# Altium project PCCC V1.1.0_001.PrjPcb
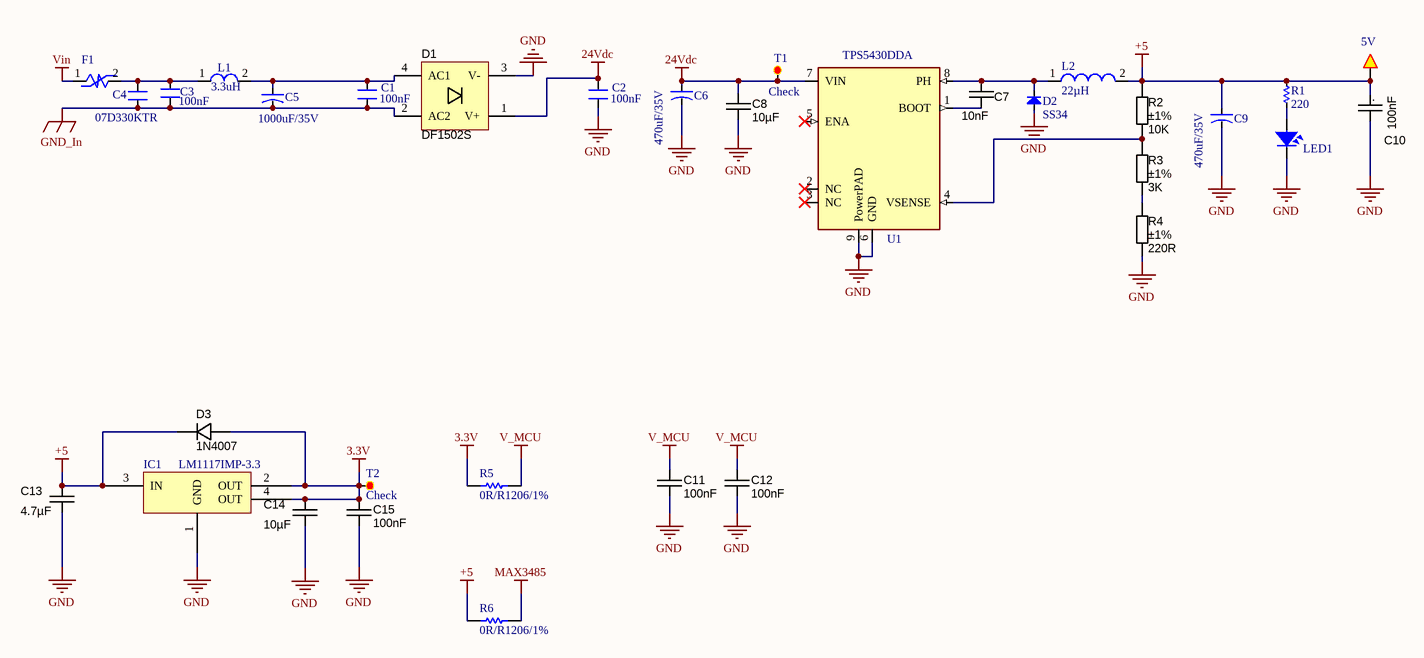
[diagram p0: Power - Switch Power.SchDoc]
8 sheets, 93 parts. Net scope: flat (ports and power ports of the same name join across sheets).
Board file: PCCC V1.1.0_001.PcbDoc
Sheets:
  Block Diagram.SchDoc
  Power - Switch Power.SchDoc
  Modbus RTU.SchDoc
  Module 4G.SchDoc
  SD Card.SchDoc
  Input Digital.SchDoc
  Led Status.SchDoc
  MCU.SchDoc

## Sheet Block Diagram.SchDoc
size A3; SheetNumber: 1; SheetTotal: 8

### Notes on the sheet
- Title
- Size:
- Date:
- A3
- Number:
- Time:
- Revision:
- Sheet
- of
- NICHIETSUVN.COM <http://NICHIETSUVN.COM>
- R&D
- File:

## Sheet Power - Switch Power.SchDoc
size A3; SheetNumber: 2; SheetTotal: 8

### Parts
C1  100nF  [CN-SMD-1206]
C2  100nF  [CN-SMD-1206]
C3  100nF  [CN2.5]
C4  07D330KTR  [CN2-T]
C5  1000uF/35V  [CA-ALU-5L]
C6  470uF/35V  [CA-ALU-6.3]
C7  10nF  [CAPC1608X90N]
C8  10µF  [CAPC2012X135N]
C9  470uF/35V  [CA-ALU-6.3]
C10  100nF  [CAPC2012X135N]
C11  100nF  [CAPC1608X90N]
C12  100nF  [CAPC1608X90N]
C13  4.7µF  [CAPC2012X135N]
C14  10µF  [CAPC2012X135N]
C15  100nF  [CAPC1608X90N]
Check1  5V  [SMD-2]
D1  DF1502S  [DIODE_DF_S]
D2  SS34  [DIO-SMD-106]
D3  1N4007  [DO-214AC]
F1  RUEF185  [RUEF165]  (value not drawn)
IC1  LM1117IMP-3.3  [SOT223]
L1  3.3uH  [L-SMD-M-7.3x4.5]
L2  22µH  [IND_COIL_8D43]
LED1  LED  [LED-0805-Blue]  (value not drawn)
R1  220  [RES-SMD-0603]
R2  value 10K  Tolerance: ±1%  [RESC1608X55N]  (hidden comment: 10K_0603_1%)
R3  value 3K  Tolerance: ±1%  [RESC1608X55N]  (hidden comment: 3K_0603_0.5%)
R4  value 220R  Tolerance: ±1%  [RESC1608X55N]  (hidden comment: 220R_0603_1%)
R5  0R/R1206/1%  [R1206]
R6  0R/R1206/1%  [R1206]
T1  Check  [SMD_1.5]
T2  Check  [SMD_1.5]
U1  TPS5430DDA  [TPS5430]

### Nets
3.3V: C14.2 C15.1 D3.A IC1.2(OUT) IC1.4(OUT) R5.1 T2.1
24Vdc: C2.2 C6.1 C8.2 D1.1(V+) T1.1 U1.7(VIN)
+5: C9.1 C10.1 C13.2 Check1.1 D3.C IC1.3(IN) L2.2 R1.1 R2.2 R6.1
GND: C2.1 C6.2 C8.1 C9.2 C10.2 C11.2 C12.2 C13.1 C14.1 C15.2 D1.3(V-) D2.1(A) IC1.1(GND) LED1.2 R4.1 U1.6(GND) U1.9(PowerPAD)
GND_In: C1.1 C3.1 C4.1 C5.2 D1.2(AC2)
MAX3485: R6.2
V_MCU: C11.1 C12.1 R5.2
Vin: F1.1
NetC1_2: C1.2 C5.1 D1.4(AC1) L1.2
NetC3_2: C3.2 C4.2 F1.2 L1.1
NetC7_1: C7.1 U1.1(BOOT)
NetC7_2: C7.2 D2.2(K) L2.1 U1.8(PH)
NetLED1_1: LED1.1 R1.2
NetR2_1: R2.1 R3.2 U1.4(VSENSE)
NetR3_1: R3.1 R4.2

Not connected (* = marked no-connect by the designer): U1 2(NC)* 3(NC)* 5(ENA)*

### Notes on the sheet
- Title
- Size:
- Date:
- A3
- Number:
- Time:
- Revision:
- Sheet
- of
- NICHIETSUVN.COM <http://NICHIETSUVN.COM>
- R&D
- File:
- (in symbol CAPC_100nF_0805_X7R_50V_10%) .

### Library data of the parts
C1-C4 = CN: Value: 33pF
C5 C6 C9 = CN-ALU-DIP: Capacitor (Semiconductor SIM Model); Value: 104; LatestRevisionDate: 17-Jul-2002; LatestRevisionNote: Re-released for DXP Platform.; PackageReference: C1206; Publisher: Altium Limited
C7 = CAPC_10000pF_0603_50V_10%: 10000pF ±10% 50V Ceramic Capacitor X7R 0603 (1608 Metric); Manufacturer 1: TDK Corporation; Manufacturer Part Number 1: CGA3E2X7R1H103K080AA; Pcs 2: 10; Tolerance: ±10%; Operating Temperature: -55°C ~ 125°C; Package / Case: 0603 (1608 Metric); Voltage - Rated: 50V; Ratings: AEC-Q200; Temperature Coefficient: X7R; Supplier Part Number 1: 445-5662-6-ND; Supplier 1: Digi-Key; Supplier 2: https://www.thegioiic.com; Supplier Part Number 2: https://www.thegioiic.com/products/tu-gom-0603-10nf-50v; Price 2: 1900; Value: 10nF
C8 = CAPC_10uF_0805_X7R_25V_10%: 10µF ±10% 50V Ceramic Capacitor X7R 1206 (3216 Metric); Manufacturer 1: Taiyo Yuden; Manufacturer Part Number: TMK316AB7106KLHT; Voltage - Rated: 25V; Pcs 2: 10; Supplier 1: Digi-Key; Supplier Part Number 1: 587-3485-6-ND; Tolerance: ±10%; Operating Temperature: -55°C ~ 125°C; Package / Case: 0805 (2012 metric); Ratings: AEC-Q200; Temperature Coefficient: X7R; Supplier 2: https://www.thegioiic.com; Supplier Part Number 2: https://www.thegioiic.com/products/tu-gom-0805-10uf-25v; Price 2: 5800; Value: 10µF
C10 = CAPC_100nF_0805_X7R_50V_10%: 0.1µF ±10% 50V Ceramic Capacitor X7R 0805 (2012 Metric); Manufacturer 1: Samsung Electro-Mechanics; Manufacturer Part Number: CL21B104KBFXPJE; Pcs 2: 10; Supplier 1: Digi-Key; Supplier Part Number 1: 1276-CL21B104KBFXPJEDKR-ND; Tolerance: ±10%; Operating Temperature: -55°C ~ 125°C; Package / Case: 0805 (2012 metric); Voltage - Rated: 50V; Ratings: AEC-Q200; Temperature Coefficient: X7R; Price 2: 2000; Supplier 2: https://www.thegioiic.com; Supplier Part Number 2: https://www.thegioiic.com/products/tu-gom-0805-100nf-0-1uf-50v; Value: 100nF
C11 C12 C15 = CAPC_100nF_0603_X7R_50V_10%: 0.1µF ±10% 50V Ceramic Capacitor X7R 0603 (1608 Metric); Manufacturer 1: TDK Corporation; Manufacturer Part Number 1: CGA3E2X7R1H104K080AA; Pcs 2: 10; Supplier 1: Digi-Key; Supplier Part Number 1: 445-5666-6-ND; Tolerance: ±10%; Operating Temperature: -55°C ~ 125°C; Package / Case: 0603 (1608 Metric); Voltage - Rated: 50V; Ratings: AEC-Q200; Temperature Coefficient: X7R; Applications: Automotive; Packaging: Digi-Reel®; Supplier 2: www.thegioiic.com; Supplier Part Number 2: https://www.thegioiic.com/products/tu-gom-0603-100nf-0-1uf-50v; Price 2: 1800; Value: 100nF
C13 C14 = CAPC_4.7uF_0805_X7R_50V_10%: 4.7µF ±10% 50V Ceramic Capacitor X7R 0805 (2012 Metric); Manufacturer 1: TDK Corporation; Manufacturer Part Number: CGA4J1X7R1H475K125AE; Pcs 2: 1; Package / Case: 0805 (2012 metric); Tolerance: ±10%; Voltage - Rated: 50V; Temperature Coefficient: X7R; Ratings: AEC-Q200; Operating Temperature: -55°C ~ 125°C; Supplier 1: Digi-Key; Supplier Part Number 1: 445-181410-6-ND; Supplier 2: https://www.thegioiic.com; Supplier Part Number 2: https://www.thegioiic.com/products/tu-gom-0805-4-7uf-50v; Price 2: 680
  C13: Value: 4.7µF
  C14: Value: 10µF
Check1 T1 T2 = Test: WR-PHD 2.54 mm Angled Socket Header; Manufacturer: W¨¹rth Elektronik eiSos GmbH; partNo: 613002143121; ComponentLink1 Description: Manufacturer; ComponentLink2 Description: Datasheet; NoPins: 02; Created Date: 29 March 2013; ComponentLink1URL: http://www.we-online.com; ComponentLink2URL: http://katalog.we-online.de/em/datasheet/6130xx143121.pdf; Created by: Karrer Zheng
D1 = DIODE_DF1502S: Bridge Rectifier Single Phase Standard 200V Surface Mount DF-S; Manufacturer 1: Diodes Incorporated; Manufacturer Part Number 1: DF1502S-T; Ratings: 200V; 1.5A; Pcs 2: 1; Package / Case: 4-SMD, Gull Wing; Diode Type: Standard; Mounting Type: Surface Mount; Supplier 1: Digi-Key; Supplier Part Number 1: DF1502SDIDKR-ND; Supplier 2: https://www.thegioiic.com; Supplier Part Number 2: https://www.thegioiic.com/products/df1502s-cau-chinh-luu-200v-1-5a; Price 2: 3500
D2 = Diode SMD: Default Diode; Code - JEDEC: DO-214-AB; Value: 1N5007; Published: 8-Jun-2000; Revision: July-2002: Re-released for DXP Platform.; Publisher: Altium Limited
D3 = DIODE_1N4007: Diode  Standard Rectifier SMD 1000V 1A SMA; Manufacturer 1: Micro Commercial Co; Manufacturer Part Number 1: SM4007PL-TP; Speed: Standard Recovery >500ns, > 200mA (Io); Ratings: 1000V; 1A; Pcs 2: 1; Package / Case: DO-214AC, SMA; Diode Type: Standard; Mounting Type: Surface Mount; Supplier 1: Digi-Key; Supplier Part Number 1: SM4007PL-TPMSDKR-ND; Supplier 2: https://www.thegioiic.com; Supplier Part Number 2: https://www.thegioiic.com/products/1n4007-m7-diode-chinh-luu-1a-1kv; Price 2: 1000
IC1 = IC_LM1117IMP-3.3: Linear Voltage Regulator IC  1 Output  800mA SOT-223; Manufacturer: Texas Instruments; Manufacturer Part Number: LM1117IMP-3.3/NOPB; Voltage - Input (Max): 15V; Voltage Dropout (Max): 1.2V @ 800mA; Protection Features: Over Current, Over Temperature; PSRR: 75dB (120Hz); Pcs 2: 1; Supplier 1: Digi-Key; Supplier Part Number 1: LM1117IMP-3.3/NOPBDKR-ND; Current - Output: 800mA; Operating Temperature: -40°C ~ 125°C; Price 2: 11000; Supplier Device Package: SOT-223; Supplier 2: https://www.thegioiic.com; Supplier Part Number 2: https://www.thegioiic.com/products/lm1117imp-3-3-nopb-ic-on-ap-3-3v-800ma
L1 = L-SMD-1: partNo: 78477010; Manufacturer: Wurth Elektronik; Inductance: 1.0 μH; ComponentLink1Description: Manufacturer; ComponentLink1URL: http://www.we-online.de; Created by: Baojun Chen; Created Date: Nov.2015; ComponentLink2Description: Datasheet; ComponentLink2URL: http://katalog.we-online.de/pbs/datasheet/78477010.pdf
L2 = INDC_SMD_22uH_8D43: 22µH Shielded Wirewound Inductor 950mA 380mOhm Max Nonstandard; Manufacturer 1: Yageo; Current Rating (Amps): 3.25 A; Ratings: None AEC-Q200; Pcs 2: 1; Supplier 1: Digi-Key; Operating Temperature: -40°C ~ 125°C; Value: 22µH; Supplier 2: https://www.thegioiic.com/; Supplier Part Number 2: https://www.thegioiic.com/products/cuon-cam-dan-smd-8d43-220-22uh-3-25a; Price 2: 2000
LED1 = LED SMD: Value: LED 3 - 5 ly 2 Colour
R1 = Res-SMD: Resistor; Manufacturer: Generic Components; Class: Passive; Published: 08/06/2000; Publisher: Altium Hobart Technology Centre
R2 = RES_10K_0603_1%: 10 kOhms ±1% 0.1W, 1/10W Chip Resistor 0603 (1608 Metric) Anti-Sulfur, Automotive AEC-Q200, Moisture Resistant Thin Film; Manufacturer: Stackpole Electronics Inc; Manufacturer Part Number: RMCF0603FT10K0; Temperature Coefficient: ±100ppm/°C; Pcs 2: 50; Package / Case: 0603 (1608 Metric); Power (Watts): 1/10W; Supplier 1: Digi-Key; Supplier Part Number 1: RMCF0603FT10K0DKR-ND; Ratings: Automotive AEC-Q200; Operating Temperature: -55°C ~ 155°C; Supplier 2: www.thegioiic.com; Supplier Part Number 2: https://www.thegioiic.com/products/dien-tro-10-kohm-0603-1; Price 2: 2000
R3 = RES_3K_0603_1%: 3 kOhms ±1% 0.1W, 1/10W Chip Resistor 0603 (1608 Metric) Automotive AEC-Q200 Thick Film; Manufacturer: Stackpole Electronics Inc; Manufacturer Part Number: RMCF0603FT3K00; Temperature Coefficient: ±100ppm/°C; Pcs 2: 50; Package / Case: 0603 (1608 Metric); Power (Watts): 1/10W; Supplier 1: Digi-Key; Supplier Part Number 1: RMCF0603FT3K00DKR-ND; Ratings: AEC-Q200; Supplier Part Number 2: https://www.thegioiic.com/products/dien-tro-3-kohm-0603-1; Supplier 2: www.thegioiic.com; Operating Temperature: -55°C ~ 155°C; Price 2: 2000
R4 = RES_220R_0603_1%: 220 Ohms ±1% 0.1W, 1/10W Chip Resistor 0603 (1608 Metric) Automotive AEC-Q200 Thick Film; Manufacturer: Stackpole Electronics Inc; Manufacturer Part Number: RMCF0603FT220R; Temperature Coefficient: ±100ppm/°C; Pcs 2: 50; Package / Case: 0603 (1608 Metric); Ratings: AEC-Q200; Supplier 1: Digi-Key; Supplier Part Number 1: RMCF0603FT220RDKR-ND; Power (Watts): 0.1W, 1/10W; Operating Temperature: -55°C ~ 155°C; Composition: Thick Film; Supplier 2: www.thegioiic.com; Supplier Part Number 2: https://www.thegioiic.com/products/dien-tro-220-ohm-0603-1; Price 2: 2000
R5 R6 = RES_0R/R1206/1%: RES SMD 0.0 OHM JUMPER 1/4W 1206; Manufacturer: Bourns Inc.; Manufacturer Part Number: CR1206-J/-000ELF; Resistance (Ohms): 0.0; Power (Watts): 0.25W, 1/4W; Temperature Coefficient: -250/ +500ppm/°C; Supplier 1: Digi-Key; RoHS: RoHS Compliant By Exemption; Category: Resistors; Stock 1: 80000; Pricing 1: 5000=0.00931, 10000=0.00809, 25000=0.00711, 50000=0.00652, 125000=0.00638 (USD); Packaging: Tape & Reel (TR); Tolerance: Jumper; Composition: Thick Film; Features: Moisture Resistant; Operating Temperature: -55°C ~ 155°C; Package / Case: 1206 (3216 Metric); Supplier Device Package: 1206; Size / Dimension: 0.126" L x 0.063" W (3.20mm x 1.60mm); Height: 0.030" (0.75mm); Number of Terminations: 2; ComponentLink1URL: http://www.bourns.com/data/global/pdfs/CHPREZTR.pdf; ComponentLink1Description: http://www.bourns.com/data/global/pdfs/CHPREZTR.pdf; Supplier Part Number 1: CR1206-J/-000ELFTR-ND

## Sheet Modbus RTU.SchDoc
size A3; SheetNumber: 3; SheetTotal: 8
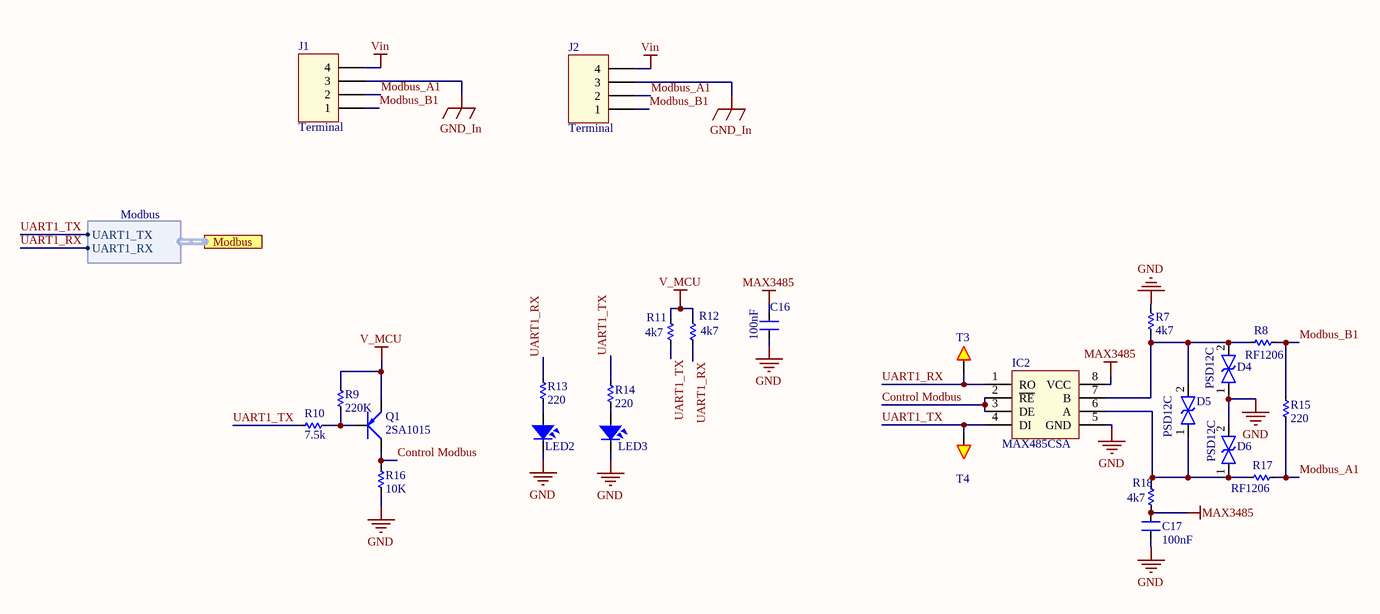
[diagram p1: Modbus RTU.SchDoc]

### Parts
C16  100nF  [CN-SMD-0603]
C17  100nF  [CN-SMD-0603]
D4  PSD12C  [PSD12C]
D5  PSD12C  [PSD12C]
D6  PSD12C  [PSD12C]
IC2  MAX485CSA  [SO8]
J1  Terminal  [691305340004]
J2  Terminal  [691305340004]
LED2  LED  [LED-0805-Blue]  (value not drawn)
LED3  LED  [LED-0805-Blue]  (value not drawn)
Q1  2SA1015  [SOT23-321]
R7  4k7  [RES-SMD-0603]
R8  RF1206  [RES-SMD-1206]
R9  220K  [RES-SMD-0603]
R10  7.5k  [RES-SMD-0603]
R11  4k7  [RES-SMD-0603]
R12  4k7  [RES-SMD-0603]
R13  220  [RES-SMD-0603]
R14  220  [RES-SMD-0603]
R15  220  [RES-SMD-0603]
R16  10K  [RES-SMD-0603]
R17  RF1206  [RES-SMD-1206]
R18  4k7  [RES-SMD-0603]
T3  Test  [Test]  (value not drawn)
T4  Test  [Test]  (value not drawn)

### Ports
Modbus (harness Modbus)

### Harnesses
Modbus: UART1_TX, UART1_RX

### Nets
GND: C16.1 C17.2 D4.1 D6.2 IC2.5(GND) LED2.2 LED3.2 R7.1 R16.1
GND_In: J1.3 J2.3
MAX3485: C16.2 C17.1 IC2.8(VCC) R18.1
V_MCU: Q1.1(E) R9.2 R11.1 R12.1
Vin: J1.4 J2.4
Control Modbus: IC2.2(~{RE}) IC2.3(DE) Q1.2(C) R16.2
Modbus_A1: J1.2 J2.2 R15.2 R17.1
Modbus_B1: J1.1 J2.1 R8.1 R15.1
UART1_RX: IC2.1(RO) R12.2 R13.1 T3.1 ; port Modbus.UART1_RX
UART1_TX: IC2.4(DI) R10.1 R11.2 R14.1 T4.1 ; port Modbus.UART1_TX
NetD4_2: D4.2 D5.2 IC2.7(B) R7.2 R8.2
NetD5_1: D5.1 D6.1 IC2.6(A) R17.2 R18.2
NetLED2_1: LED2.1 R13.2
NetLED3_1: LED3.1 R14.2
NetQ1_3: Q1.3(B) R9.1 R10.2

### Notes on the sheet
- Title
- Size:
- Date:
- A3
- Number:
- Time:
- Revision:
- Sheet
- of
- NICHIETSUVN.COM <http://NICHIETSUVN.COM>
- R&D
- File:

### Library data of the parts
C16 C17 = CN: Value: 33pF
D4-D6 = PSD12C: diode tvs
IC2 = MAX485: RS232 - RS485 (Same sn75176)
J1 J2 = 691305340004: WR-TBL Serie 3053 - 3.81 mm Horizontal PCB Header with Plastic Latch, 04p; Pitch: 3.81 mm; Published Date: Jan 2017; Publisher: Wurth Elektronik; ComponentLink1Description: Manufacturer; ComponentLink1URL: http://www.we-online.de; ComponentLink2Description: Datasheet; ComponentLink2URL: http://katalog.we-online.de/em/datasheet/691305340004.pdf; Part Number: 691305340004; Pin Number: 04p
LED2 LED3 = LED SMD: Value: LED 3 - 5 ly 2 Colour
Q1 = 2SA1015: PNP 600mW, ECB; Value: A1015
R7-R18 = Res-SMD: as R1 on sheet Power - Switch Power; Published: 08/06/2000; Publisher: Altium Hobart Technology Centre
T3 T4 = Test: as Check1 on sheet Power - Switch Power; Created Date: 29 March 2013; ComponentLink1URL: http://www.we-online.com; ComponentLink2URL: http://katalog.we-online.de/em/datasheet/6130xx143121.pdf; Created by: Karrer Zheng

## Sheet Module 4G.SchDoc
size A3; SheetNumber: 4; SheetTotal: 8
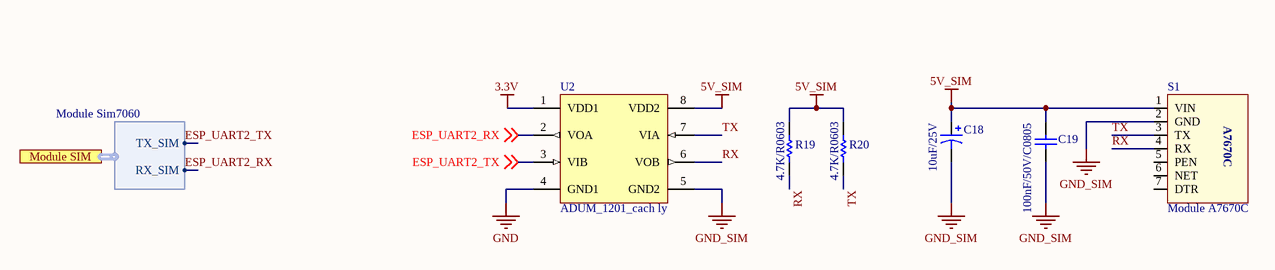
[diagram p2: Module 4G.SchDoc]

### Parts
C18  10uF/25V  [CAP TANT SIZE B]
C19  100nF/50V/C0805  [C0805]
R19  4.7K/R0603  [R0603]
R20  4.7K/R0603  [R0603]
S1  Module A7670C  [Module A7670C]
U2  ADUM_1201_cach ly  [ADUM1201]

### Ports
Module SIM (harness Module Sim7060)

### Harnesses
Module Sim7060: TX_SIM, RX_SIM

### Nets
3.3V: U2.1(VDD1)
5V_SIM: C18.1(+) C19.2 R19.2 R20.2 S1.1(VIN) U2.8(VDD2)
GND: U2.4(GND1)
GND_SIM: C18.2(-) C19.1 S1.2(GND) U2.5(GND2)
ESP_UART2_RX: U2.2(VOA) ; off-sheet ESP_UART2_RX, port Module SIM.RX_SIM
ESP_UART2_TX: U2.3(VIB) ; off-sheet ESP_UART2_TX, port Module SIM.TX_SIM
RX: R19.1 S1.4(RX) U2.6(VOB)
TX: R20.1 S1.3(TX) U2.7(VIA)

Not connected (* = marked no-connect by the designer): S1 5(PEN) 6(NET) 7(DTR)

### Notes on the sheet
- Title
- Size:
- Date:
- A3
- Number:
- Time:
- Revision:
- Sheet
- of
- NICHIETSUVN.COM <http://NICHIETSUVN.COM>
- R&D
- File:
- (in symbol Module A7670C) A7670C

### Library data of the parts
C18 = 10uF/25V/SIZE B/10%: CAP TANT 10UF 25V 10% 1411; Manufacturer: KEMET; Manufacturer Part Number: T491B106K025AT; Manufacturer Size Code: B; Capacitance: 10µF; Type: Molded; ESR (Equivalent Series Resistance): 3 Ohm; Lifetime @ Temp.: 2000 Hrs @ 85°C; Supplier 1: Digi-Key; RoHS: RoHS Compliant; Category: Capacitors; Stock 1: 74222; Pricing 1: 1=1.11, 10=0.842, 25=0.7448, 50=0.6994, 100=0.6022, 250=0.54392, 500=0.46622, 1000=0.40147 (USD); Packaging: Cut Tape (CT); Part Status: Active; Tolerance: ±10%; Voltage - Rated: 25V; Operating Temperature: -55°C ~ 125°C; Mounting Type: Surface Mount; Package / Case: 1411 (3528 Metric); Size / Dimension: 0.138" L x 0.110" W (3.50mm x 2.80mm); Height - Seated (Max): 0.083" (2.10mm); Lead Spacing: -; Features: General Purpose; Failure Rate: -; ComponentLink1URL: http://www.kemet.com/Lists/ProductCatalog/Attachments/254/KEM_T2005_T491.pdf; ComponentLink1Description: http://www.kemet.com/Lists/ProductCatalog/Attachments/254/KEM_T2005_T491.pdf; Supplier Part Number 1: 399-5125-1-ND
C19 = 0.1uF/50V/C0805/10%: CAP CER 0.1UF 50V 10% X7R 0805; Manufacturer: Samsung Electro-Mechanics America, Inc.; Manufacturer Part Number: CL21B104KBCNNNC; Capacitance: 0.1µF; RoHS: RoHS Compliant; Category: Capacitors; Packaging: Cut Tape (CT); Tolerance: ±10%; Voltage - Rated: 50V; Temperature Coefficient: X7R; Mounting Type: Surface Mount, MLCC; Operating Temperature: -55°C ~ 125°C; Applications: General Purpose; Ratings: -; Package / Case: 0805 (2012 Metric); Size / Dimension: 0.079" L x 0.049" W (2.00mm x 1.25mm); Height - Seated (Max): -; Thickness (Max): 0.037" (0.95mm); Lead Spacing: -; Features: -; Lead Style: -; ComponentLink1URL: http://www.samsungsem.com/kr/front/downloadcms.do?path=/kr/support/product-search/mlcc/__icsFiles/afieldfile/2015/04/16&fileName=CL21B104KBCNNNC.pdf; ComponentLink1Description: http://www.samsungsem.com/kr/front/downloadcms.do?path=/kr/support/product-search/mlcc/__icsFiles/afieldfile/2015/04/16&fileName=CL21B104KBCNNNC.pdf; Supplier 1: Digi-Key; Supplier Part Number 1: 1276-1003-1-ND
R19 R20 = 4.7K/R0603/1%: RES SMD 4.7K OHM 1% 1/10W 0603; Manufacturer: Yageo; Manufacturer Part Number: RC0603FR-074K7L; Power (Watts): 0.1W, 1/10W; Temperature Coefficient: ±100ppm/°C; Supplier 1: Digi-Key; RoHS: RoHS Compliant; Category: Resistors; Stock 1: 3295420; Pricing 1: 1=0.1, 10=0.014, 25=0.01, 100=0.0057, 250=0.00436, 500=0.00348, 1000=0.00257, 2500=0.00223 (USD); Packaging: Cut Tape (CT); Resistance (Ohms): 4.7k; Tolerance: ±1%; Composition: Thick Film; Features: Moisture Resistant; Operating Temperature: -55°C ~ 155°C; Package / Case: 0603 (1608 Metric); Supplier Device Package: 0603; Size / Dimension: 0.063" L x 0.031" W (1.60mm x 0.80mm); Height: 0.022" (0.55mm); Number of Terminations: 2; ComponentLink1URL: http://www.yageo.com/NewPortal/yageodocoutput?fileName=/pdf/R-Chip/PYu-RC_Group_51_RoHS_L_3.pdf; ComponentLink1Description: http://www.yageo.com/NewPortal/yageodocoutput?fileName=/pdf/R-Chip/PYu-RC_Group_51_RoHS_L_3.pdf; Supplier Part Number 1: 311-4.70KHRCT-ND; PN_LCSC: *; Link_LCSC: *; DNI: *
S1 = Module A7670C: ComponentLink1Description: Buy; ComponentLink1URL: https://linhkienthuduc.com/module-4g-simcom-a7670cas-da-ra-chan-thay-the-module-sim800l?fbclid=IwAR1G5wYYUv7p81VrcWdIp5blH95Ph3Cg0YzZirZTlKBqqVU0n-BOBnrUa-4

## Sheet SD Card.SchDoc
size A3; SheetNumber: 5; SheetTotal: 8
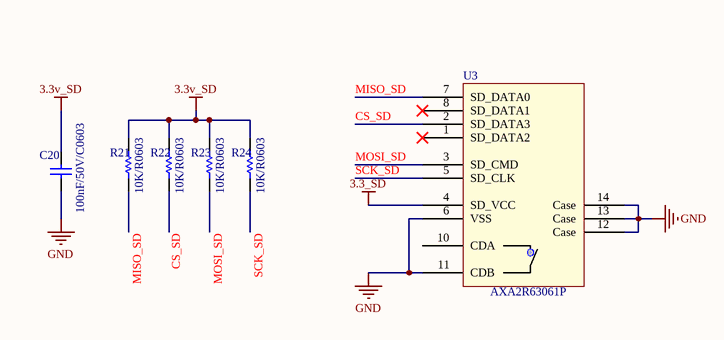
[diagram p3: SD Card.SchDoc]

### Parts
C20  100nF/50V/C0603  [C0603]
R21  10K/R0603  [R0603]
R22  10K/R0603  [R0603]
R23  10K/R0603  [R0603]
R24  10K/R0603  [R0603]
U3  AXA2R63061P  [mini SD card - T-flash]

### Nets
3.3_SD: U3.4(SD_VCC)
3.3v_SD: C20.2 R21.2 R22.2 R23.2 R24.2
GND: C20.1 U3.6(VSS) U3.11(CDB) U3.12(Case) U3.13(Case) U3.14(Case)
CS_SD: U3.2(SD_DATA3)
MISO_SD: R21.1 U3.7(SD_DATA0)
MOSI_SD: R23.1 U3.3(SD_CMD)
SCK_SD: R24.1 U3.5(SD_CLK)

Not connected (* = marked no-connect by the designer): R22 1; U3 1(SD_DATA2)* 8(SD_DATA1)* 10(CDA)

### Notes on the sheet
- Labels drawn without touching a wire or pin: CS_SD
- Title
- Size:
- Date:
- A3
- Number:
- Time:
- Revision:
- Sheet
- of
- NICHIETSUVN.COM <http://NICHIETSUVN.COM>
- R&D
- File:

### Library data of the parts
C20 = 0.1uF/50V/C0603/10%: CAP CER 0.1UF 50V 10% X7R 0603; Manufacturer: Murata Electronics North America; Manufacturer Part Number: GRM188R71H104KA93D; Capacitance: 0.1µF; RoHS: RoHS Compliant; Category: Capacitors; Packaging: Tape & Reel (TR); Tolerance: ±10%; Voltage - Rated: 50V; Temperature Coefficient: X7R; Mounting Type: Surface Mount, MLCC; Operating Temperature: -55°C ~ 125°C; Applications: General Purpose; Ratings: -; Package / Case: 0603 (1608 Metric); Size / Dimension: 0.063" L x 0.031" W (1.60mm x 0.80mm); Height - Seated (Max): -; Thickness (Max): 0.035" (0.90mm); Lead Spacing: -; Features: -; Lead Style: -; ComponentLink1URL: http://www.murata.com/~/media/webrenewal/support/library/catalog/products/capacitor/mlcc/c02e.ashx; ComponentLink1Description: http://www.murata.com/~/media/webrenewal/support/library/catalog/products/capacitor/mlcc/c02e.ashx; Supplier 1: Digi-Key; Supplier Part Number 1: 490-1519-1-ND
R21-R24 = 10K/R0603/1%: RES SMD 10K OHM 1% 1/10W 0603; Manufacturer: Yageo; Manufacturer Part Number: RC0603FR-0710KL; Power (Watts): 0.1W, 1/10W; Temperature Coefficient: ±100ppm/°C; Supplier 1: Digi-Key; RoHS: RoHS Compliant; Category: Resistors; Stock 1: 11440000; Pricing 1: 5000=0.00167, 10000=0.00145, 25000=0.00128, 50000=0.00117, 125000=0.00115 (USD); Packaging: Tape & Reel (TR); Resistance (Ohms): 10k; Tolerance: ±1%; Composition: Thick Film; Features: Moisture Resistant; Operating Temperature: -55°C ~ 155°C; Package / Case: 0603 (1608 Metric); Supplier Device Package: 0603; Size / Dimension: 0.063" L x 0.031" W (1.60mm x 0.80mm); Height: 0.022" (0.55mm); Number of Terminations: 2; ComponentLink1URL: http://www.yageo.com/NewPortal/yageodocoutput?fileName=/pdf/R-Chip/PYu-RC_Group_51_RoHS_L_3.pdf; ComponentLink1Description: http://www.yageo.com/NewPortal/yageodocoutput?fileName=/pdf/R-Chip/PYu-RC_Group_51_RoHS_L_3.pdf; Supplier Part Number 1: 311-10.0KHRTR-ND; PN_LCSC: *; Link_LCSC: *; DNI: *
U3 = MICRO SD CARD P-P R/A SMD: CONN SD CARD PUSH-PUSH R/A SMD; Manufacturer: Panasonic Electric Works; Card Type: Secure Digital - SD; Number of Positions: 12 (9 + 3); Connector Type: Connector and Ejector; Insertion, Removal Method: Push In, Push Out; Supplier 1: Digi-Key; Manufacturer Part Number: AXA2R63061P; RoHS: RoHS Compliant; Category: Connectors, Interconnects; Stock 1: 0; Pricing 1: 350=0 (USD); Packaging: Tape & Reel (TR); Part Status: Obsolete; Ejector Side: -; Mounting Type: Surface Mount, Right Angle; Features: Board Guide, Switch; Height Above Board: 0.134" (3.40mm); Mounting Feature: Normal, Standard - Top; Contact Finish: Gold; Contact Finish Thickness: Flash; ComponentLink1URL: http://media.digikey.com/pdf/Data%20Sheets/Panasonic%20Electric%20Works%20PDFs/AXA2R%20Rev.Oct1,2009.pdf; ComponentLink1Description: http://media.digikey.com/pdf/Data%20Sheets/Panasonic%20Electric%20Works%20PDFs/AXA2R%20Rev.Oct1,2009.pdf

## Sheet Input Digital.SchDoc
size A3; SheetNumber: 6; SheetTotal: 8
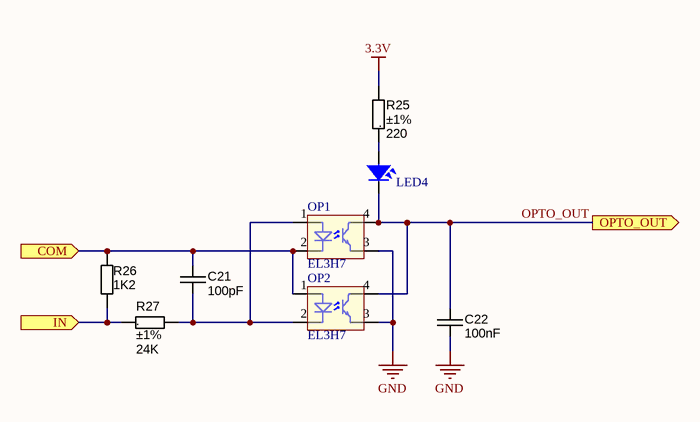
[diagram p4: Input Digital.SchDoc]

### Parts
C21  100pF  [CAPC1608X90N]
C22  100nF  [CAPC1608X90N]
LED4  LED  [LED-0805-Green]  (value not drawn)
OP1  EL3H7  [IC_SMD_SSOP4_NEW]
OP2  EL3H7  [IC_SMD_SSOP4_NEW]
R25  value 220  Tolerance: ±1%  [RESC1608X55N]  (hidden comment: 10K_0603_1%)
R26  value 1K2  [RES_2W_AXIAL_11x4_STAND]  (hidden comment: Metal Film)
R27  value 24K  Tolerance: ±1%  [RESC2012X70N]  (hidden comment: 24K_0805_1%)

### Ports
COM (in), IN (in), OPTO_OUT (out)

### Nets
3.3V: R25.2
GND: C22.2 OP1.3(E) OP2.3(E)
OPTO_OUT: C22.1 LED4.2 OP1.4(C) OP2.4(C) ; port OPTO_OUT
NetC21_1: C21.1 OP1.2(K) OP2.1(A) R26.1 ; port COM
NetC21_2: C21.2 OP1.1(A) OP2.2(K) R27.2
NetLED4_1: LED4.1 R25.1
NetR26_2: R26.2 R27.1 ; port IN

### Notes on the sheet
- Title
- Size:
- Date:
- A3
- Number:
- Time:
- Revision:
- Sheet
- of
- NICHIETSUVN.COM <http://NICHIETSUVN.COM>
- R&D
- File:
- (in symbol RES_10K_0603_1%) .
- (in symbol RES_24K_0805_1%) .

### Library data of the parts
C21 = CAPC_100pF_0603_C0G_NP0_100V_5%: 100pF ±5% 100V Ceramic Capacitor C0G, NP0 0603 (1608 Metric); Manufacturer 1: TDK Corporation; Pcs 2: 10; Tolerance: ±5%; Operating Temperature: -55°C ~ 125°C; Package / Case: 0603 (1608 Metric); Voltage - Rated: 100V; Temperature Coefficient: C0G, NP0; Ratings: AEC-Q200; Applications: Automotive; Packaging: Digi-Reel®; Supplier 1: Digi-Key; Supplier Part Number 1: 445-5724-6-ND; Value: 100pF; Supplier 2: https://www.thegioiic.com; Supplier Part Number 2: https://www.thegioiic.com/products/tu-gom-0603-100pf-50v; Price 2: 1800
C22 = CAPC_100nF_0603_X7R_50V_10%: as C11 on sheet Power - Switch Power; Supplier 1: Digi-Key; Supplier Part Number 1: 445-5666-6-ND; Tolerance: ±10%; Operating Temperature: -55°C ~ 125°C; Package / Case: 0603 (1608 Metric); Voltage - Rated: 50V; Ratings: AEC-Q200; Temperature Coefficient: X7R; Applications: Automotive; Packaging: Digi-Reel®; Supplier 2: www.thegioiic.com; Supplier Part Number 2: https://www.thegioiic.com/products/tu-gom-0603-100nf-0-1uf-50v; Price 2: 1800; Value: 100nF
LED4 = LED SMD: Value: LED 3 - 5 ly 2 Colour
OP1 OP2 = OPTO_EL3H7: Photo Transistor; Manufacturer Part Number 1: EL3H7(TA)-VG; Manufacturer 1: Everlight Electronics Co Ltd; Pcs 2: 1; Operating Temperature: -55°C ~ 110°C; Supplier 1: Digi-Key; Supplier Part Number 1: 1080-1198-6-ND; Supplier 2: linhkien.cxt.vn; Supplier Part Number 2: https://linhkien.cxt.vn/2637-el3h7bta-vg.html; Price 2: 1100
R25 = RES_10K_0603_1%: as R2 on sheet Power - Switch Power; Package / Case: 0603 (1608 Metric); Power (Watts): 1/10W; Supplier 1: Digi-Key; Supplier Part Number 1: RMCF0603FT10K0DKR-ND; Ratings: Automotive AEC-Q200; Operating Temperature: -55°C ~ 155°C; Supplier 2: www.thegioiic.com; Supplier Part Number 2: https://www.thegioiic.com/products/dien-tro-10-kohm-0603-1; Price 2: 2000
R26 = RES_390R_Axial_2W_5%: Resistor THD 390 Ohm 2W 5% Metal Film; Manufacturer 1: Yageo; Manufacturer Part Number 1: FMP200JR-52-390R; Pcs 2: 1; Tolerance: ±5%; Size / Dimension: 0.154" Dia x 0.354" L (3.90mm x 9.00mm); Power (Watts): 2W; Supplier 2: https://www.thegioiic.com; Supplier Part Number 2: https://www.thegioiic.com/products/dien-tro-390-ohm-2w-5-4-vong-mau; Price 2: 500; Supplier 1: Digi-Key; Supplier Part Number 1: 390ZTR-ND
R27 = RES_24K_0805_1%: 24 kOhms ±1% 0.125W, 1/8W Chip Resistor 0805 (2012 Metric) Automotive AEC-Q200 Thick Film; Manufacturer: Stackpole Electronics Inc; Manufacturer Part Number: RMCF0805FT10K5; Power (Watts): 0.1W, 1/10W; Temperature Coefficient: ±100ppm/°C; Pcs 2: 50; Package / Case: 0805 (2012 Metric); Features: Automotive AEC-Q200; Supplier 1: Digi-Key; Supplier Part Number 1: RMCF0805FT24K0DKR-ND; Operating Temperature: -55°C ~ 155°C; Supplier 2: www.thegioiic.com; Supplier Part Number 2: https://www.thegioiic.com/products/dien-tro-24-kohm-0805-5; Price 2: 1800

## Sheet Led Status.SchDoc
size A3; SheetNumber: 7; SheetTotal: 8
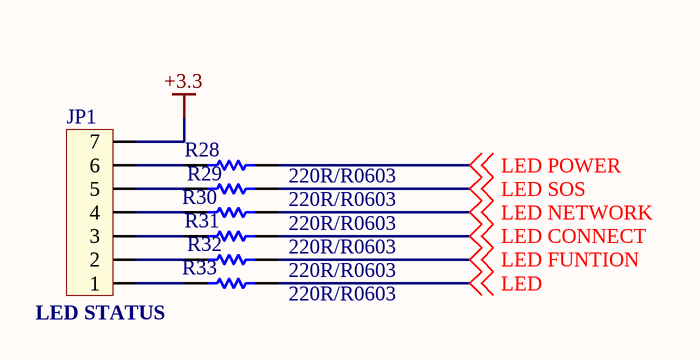
[diagram p5: Led Status.SchDoc]

### Parts
JP1  LED STATUS  [LED_VIEW_SMD]
R28  220R/R0603  [R0603]
R29  220R/R0603  [R0603]
R30  220R/R0603  [R0603]
R31  220R/R0603  [R0603]
R32  220R/R0603  [R0603]
R33  220R/R0603  [R0603]

### Nets
+3.3: JP1.7
LED: R33.2 ; off-sheet LED
LED CONNECT: R31.2 ; off-sheet LED CONNECT
LED FUNTION: R32.2 ; off-sheet LED FUNTION
LED NETWORK: R30.2 ; off-sheet LED NETWORK
LED POWER: R28.2 ; off-sheet LED POWER
LED SOS: R29.2 ; off-sheet LED SOS
NetJP1_1: JP1.1 R33.1
NetJP1_2: JP1.2 R32.1
NetJP1_3: JP1.3 R31.1
NetJP1_4: JP1.4 R30.1
NetJP1_5: JP1.5 R29.1
NetJP1_6: JP1.6 R28.1

### Notes on the sheet
- Title
- Size:
- Date:
- A3
- Number:
- Time:
- Revision:
- Sheet
- of
- NICHIETSUVN.COM <http://NICHIETSUVN.COM>
- R&D
- File:

### Library data of the parts
JP1 = Header7: Connector 7; Value: Connector 7
R28-R33 = 220R/R0603/1%: RES SMD 220 OHM 1% 1/10W 0603; Manufacturer: Yageo; Manufacturer Part Number: RC0603JR-07220RL; Resistance (Ohms): 220; Power (Watts): 0.1W, 1/10W; Temperature Coefficient: ±100ppm/°C; Supplier 1: Digi-Key; RoHS: RoHS Compliant; Category: Resistors; Stock 1: 317086; Pricing 1: 1=0.1, 10=0.011, 25=0.008, 100=0.0044, 250=0.00336, 500=0.0027, 1000=0.00198, 2500=0.00172 (USD); Packaging: Cut Tape (CT); Tolerance: ±1%; Composition: Thick Film; Features: Moisture Resistant; Operating Temperature: -55°C ~ 155°C; Package / Case: 0603 (1608 Metric); Supplier Device Package: 0603; Size / Dimension: 0.063" L x 0.031" W (1.60mm x 0.80mm); Height: 0.022" (0.55mm); Number of Terminations: 2; ComponentLink1URL: http://www.yageo.com/NewPortal/yageodocoutput?fileName=/pdf/R-Chip/PYu-RC_Group_51_RoHS_L_3.pdf; ComponentLink1Description: http://www.yageo.com/NewPortal/yageodocoutput?fileName=/pdf/R-Chip/PYu-RC_Group_51_RoHS_L_3.pdf; Supplier Part Number 1: 311-220GRCT-ND

## Sheet MCU.SchDoc
size A3; SheetNumber: 8; SheetTotal: 8
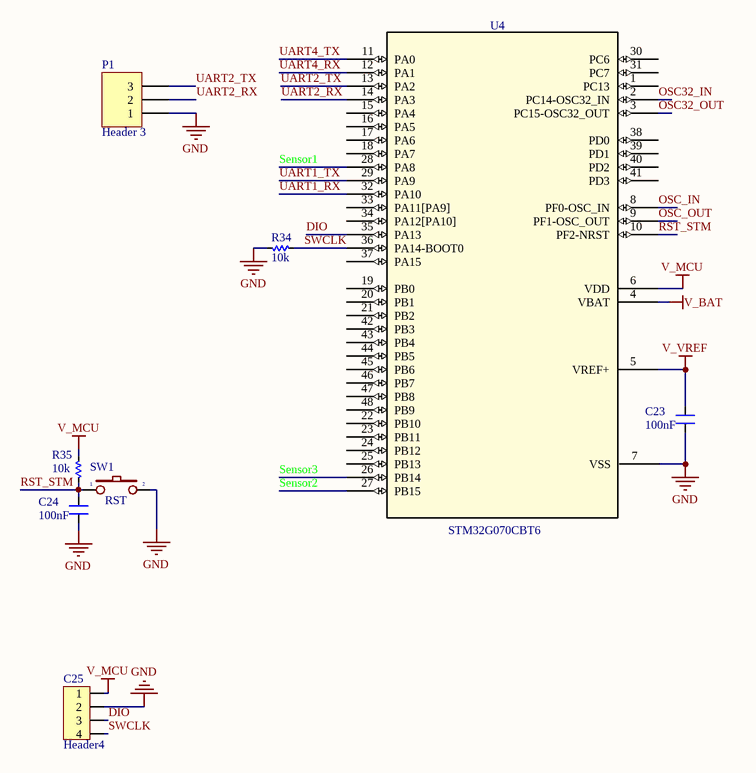
[diagram p6: MCU.SchDoc]

### Parts
C23  100nF  [CN-SMD-0603]
C24  100nF  [CN-SMD-0603]
C25  Header4  [Header4]
P1  Header 3  [Header 3]
R34  10k  [RES-SMD-0603]
R35  10k  [RES-SMD-0603]
SW1  RST  [SW1-SMD]
U4  STM32G070CBT6  [STM32G070CBT6]

### Nets
GND: C23.2 C24.2 C25.2 P1.1 R34.2 SW1.2 U4.7(VSS)
V_BAT: U4.4(VBAT)
V_MCU: C25.1 R35.1 U4.6(VDD)
V_VREF: C23.1 U4.5(VREF+)
DIO: C25.3 U4.35(PA13)
OSC32_IN: U4.2(PC14-OSC32_IN)
OSC32_OUT: U4.3(PC15-OSC32_OUT)
OSC_IN: U4.8(PF0-OSC_IN)
OSC_OUT: U4.9(PF1-OSC_OUT)
RST_STM: C24.1 R35.2 SW1.1 U4.10(PF2-NRST)
Sensor1: U4.28(PA8)
Sensor2: U4.27(PB15)
Sensor3: U4.26(PB14)
SWCLK: C25.4 R34.1 U4.36(PA14-BOOT0)
UART1_RX: U4.32(PA10)
UART1_TX: U4.29(PA9)
UART2_RX: P1.2 U4.14(PA3)
UART2_TX: P1.3 U4.13(PA2)
UART4_RX: U4.12(PA1)
UART4_TX: U4.11(PA0)

Not connected (* = marked no-connect by the designer): U4 1(PC13) 15(PA4) 16(PA5) 17(PA6) 18(PA7) 19(PB0) 20(PB1) 21(PB2) 22(PB10) 23(PB11) 24(PB12) 25(PB13) 30(PC6) 31(PC7) 33(PA11[PA9]) 34(PA12[PA10]) 37(PA15) 38(PD0) 39(PD1) 40(PD2) 41(PD3) 42(PB3) 43(PB4) 44(PB5) 45(PB6) 46(PB7) 47(PB8) 48(PB9)

### Notes on the sheet
- Title
- Size:
- Date:
- A3
- Number:
- Time:
- Revision:
- Sheet
- of
- NICHIETSUVN.COM <http://NICHIETSUVN.COM>
- R&D
- File:

### Library data of the parts
C23 C24 = CN: Value: 33pF
C25 = Header4: Header IDC, 4 x 1 Pin Vertical 2.54mm Pitch (Non-Boxed, Male); Manufacturer: W¨¹rth Elektronik eiSos GmbH; partNo: 613002143121; ComponentLink1 Description: Manufacturer; ComponentLink2 Description: Datasheet; NoPins: 02; Created Date: 29 March 2013; ComponentLink1URL: http://www.we-online.com; ComponentLink2URL: http://katalog.we-online.de/em/datasheet/6130xx143121.pdf; Created by: Karrer Zheng
P1 = Header 3: Header, 3-Pin; LatestRevisionDate: 17-Jul-2002; LatestRevisionNote: Re-released for DXP Platform.; Publisher: Altium Limited
R34 R35 = Res-SMD: as R1 on sheet Power - Switch Power; Published: 08/06/2000; Publisher: Altium Hobart Technology Centre
SW1 = SW2: Switch button 2 pin; Value: SW chip 2 pin
U4 = STM32G070CBT6: No Description Available; Vendor: STMicroelectronics; Built_By: EMA_UL_Team; SourceLibrary: Updates_to_database_2020-10-19; Manufacturer_Part_Number: STM32G070CBT6; Copyright: Copyright (C) 2018 Accelerated Designs. All rights reserved; RefDes: RefDes; Type: DEV

## Nets that join several sheets
3.3V: Power - Switch Power (7 pins), Module 4G (U2.1), Input Digital (R25.2)
GND: Power - Switch Power (17 pins), Modbus RTU (9 pins), Module 4G (U2.4), SD Card (6 pins), Input Digital (C22.2 OP1.3 OP2.3), MCU (7 pins)
GND_In: Power - Switch Power (5 pins), Modbus RTU (J1.3 J2.3)
MAX3485: Power - Switch Power (R6.2), Modbus RTU (C16.2 C17.1 IC2.8 R18.1)
V_MCU: Power - Switch Power (C11.1 C12.1 R5.2), Modbus RTU (Q1.1 R9.2 R11.1 R12.1), MCU (C25.1 R35.1 U4.6)
Vin: Power - Switch Power (F1.1), Modbus RTU (J1.4 J2.4)